# Altium project PA-HF_100W-VHF_60W.PrjPcb (part 2 of 2)

## Sheet PA-LPF.SchDoc
size A4 portrait; SheetNumber: 4; SheetTotal: 5
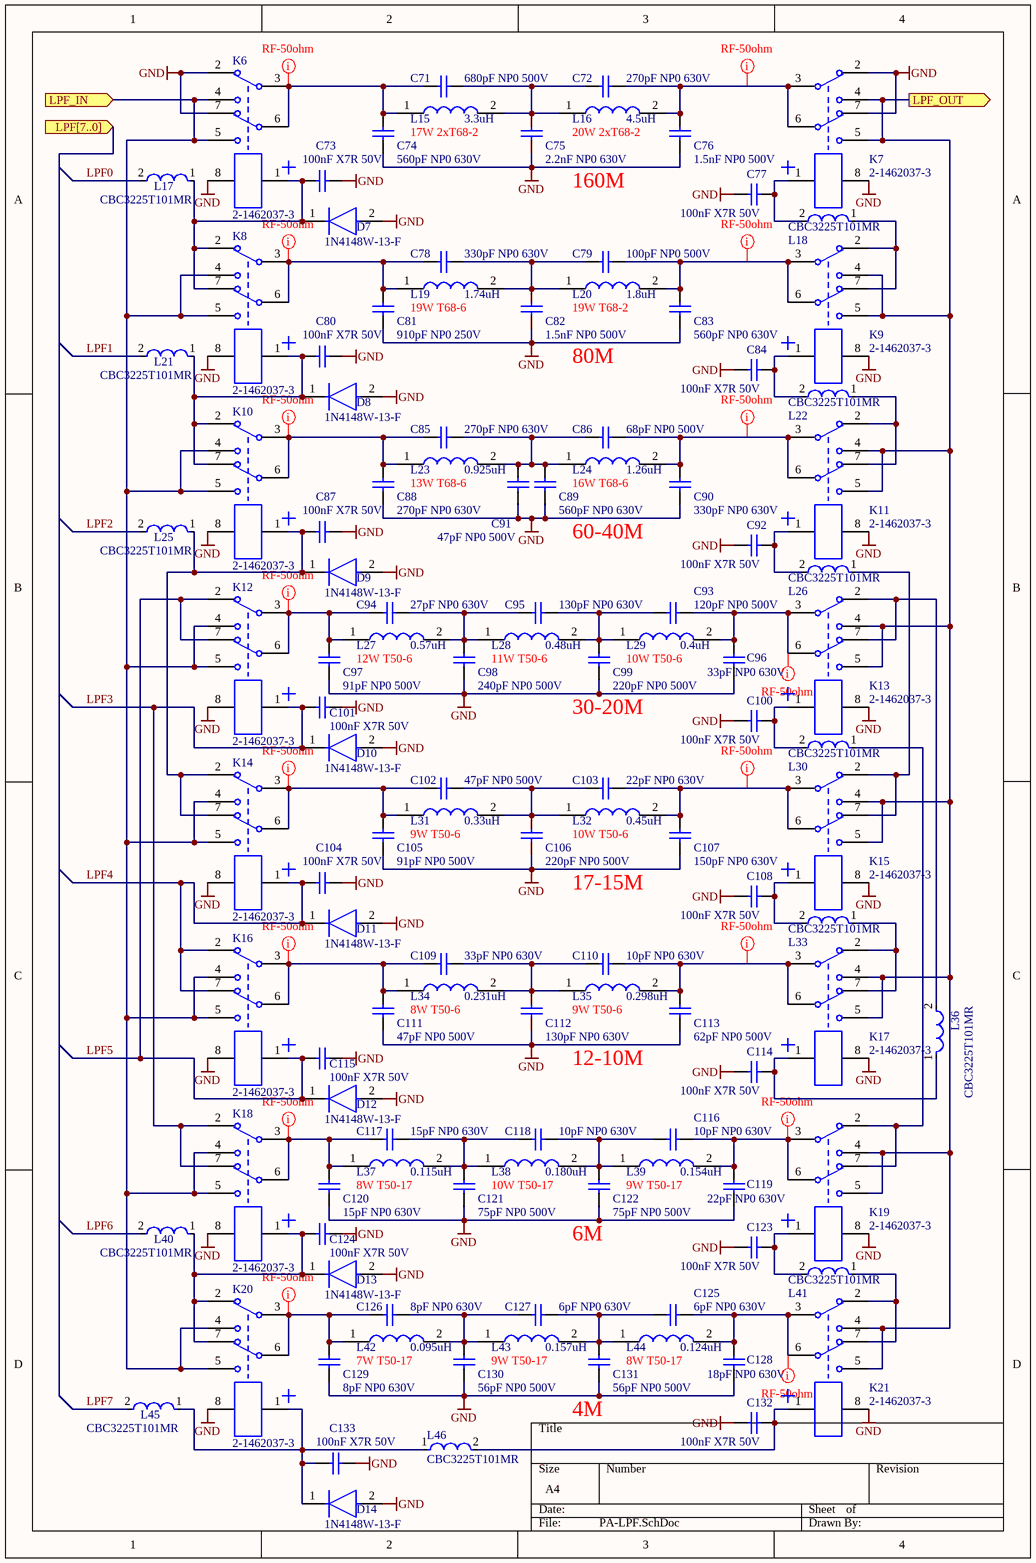
[diagram p3: PA-LPF.SchDoc]

### Parts
C71  680pF NP0 500V  [C-1206]
C72  270pF NP0 630V  [C-1206]
C73  100nF X7R 50V  [C-0805]
C74  560pF NP0 630V  [C-1206]
C75  2.2nF NP0 630V  [C-1206]
C76  1.5nF NP0 500V  [C-1206]
C77  100nF X7R 50V  [C-0805]
C78  330pF NP0 630V  [C-1206]
C79  100pF NP0 500V  [C-1206]
C80  100nF X7R 50V  [C-0805]
C81  910pF NP0 250V  [C-1206]
C82  1.5nF NP0 500V  [C-1206]
C83  560pF NP0 630V  [C-1206]
C84  100nF X7R 50V  [C-0805]
C85  270pF NP0 630V  [C-1206]
C86  68pF NP0 500V  [C-1206]
C87  100nF X7R 50V  [C-0805]
C88  270pF NP0 630V  [C-1206]
C89  560pF NP0 630V  [C-1206]
C90  330pF NP0 630V  [C-1206]
C91  47pF NP0 500V  [C-1206]
C92  100nF X7R 50V  [C-0805]
C93  120pF NP0 500V  [C-1206]
C94  27pF NP0 630V  [C-1206]
C95  130pF NP0 630V  [C-1206]
C96  33pF NP0 630V  [C-1206]
C97  91pF NP0 500V  [C-1206]
C98  240pF NP0 500V  [C-1206]
C99  220pF NP0 500V  [C-1206]
C100  100nF X7R 50V  [C-0805]
C101  100nF X7R 50V  [C-0805]
C102  47pF NP0 500V  [C-1206]
C103  22pF NP0 630V  [C-1206]
C104  100nF X7R 50V  [C-0805]
C105  91pF NP0 500V  [C-1206]
C106  220pF NP0 500V  [C-1206]
C107  150pF NP0 630V  [C-1206]
C108  100nF X7R 50V  [C-0805]
C109  33pF NP0 630V  [C-1206]
C110  10pF NP0 630V  [C-1206]
C111  47pF NP0 500V  [C-1206]
C112  130pF NP0 630V  [C-1206]
C113  62pF NP0 500V  [C-1206]
C114  100nF X7R 50V  [C-0805]
C115  100nF X7R 50V  [C-0805]
C116  10pF NP0 630V  [C-1206]
C117  15pF NP0 630V  [C-1206]
C118  10pF NP0 630V  [C-1206]
C119  22pF NP0 630V  [C-1206]
C120  15pF NP0 630V  [C-1206]
C121  75pF NP0 500V  [C-1206]
C122  75pF NP0 500V  [C-1206]
C123  100nF X7R 50V  [C-0805]
C124  100nF X7R 50V  [C-0805]
C125  6pF NP0 630V  [C-1206]
C126  8pF NP0 630V  [C-1206]
C127  6pF NP0 630V  [C-1206]
C128  18pF NP0 630V  [C-1206]
C129  8pF NP0 630V  [C-1206]
C130  56pF NP0 500V  [C-1206]
C131  56pF NP0 500V  [C-1206]
C132  100nF X7R 50V  [C-0805]
C133  100nF X7R 50V  [C-0805]
D7  1N4148W-13-F  [FP-SOD123-MFG]
D8  1N4148W-13-F  [FP-SOD123-MFG]
D9  1N4148W-13-F  [FP-SOD123-MFG]
D10  1N4148W-13-F  [FP-SOD123-MFG]
D11  1N4148W-13-F  [FP-SOD123-MFG]
D12  1N4148W-13-F  [FP-SOD123-MFG]
D13  1N4148W-13-F  [FP-SOD123-MFG]
D14  1N4148W-13-F  [FP-SOD123-MFG]
K6  2-1462037-3  [TECO-2-1462037-3_V]
K7  2-1462037-3  [TECO-2-1462037-3_V]
K8  2-1462037-3  [TECO-2-1462037-3_V]
K9  2-1462037-3  [TECO-2-1462037-3_V]
K10  2-1462037-3  [TECO-2-1462037-3_V]
K11  2-1462037-3  [TECO-2-1462037-3_V]
K12  2-1462037-3  [TECO-2-1462037-3_V]
K13  2-1462037-3  [TECO-2-1462037-3_V]
K14  2-1462037-3  [TECO-2-1462037-3_V]
K15  2-1462037-3  [TECO-2-1462037-3_V]
K16  2-1462037-3  [TECO-2-1462037-3_V]
K17  2-1462037-3  [TECO-2-1462037-3_V]
K18  2-1462037-3  [TECO-2-1462037-3_V]
K19  2-1462037-3  [TECO-2-1462037-3_V]
K20  2-1462037-3  [TECO-2-1462037-3_V]
K21  2-1462037-3  [TECO-2-1462037-3_V]
L15  17W 2xT68-2  value 3.3uH  [Amidon_2xT68_2]
L16  20W 2xT68-2  value 4.5uH  [Amidon_2xT68_2]
L17  CBC3225T101MR  [FP-CB3225-MFG]
L18  CBC3225T101MR  [FP-CB3225-MFG]
L19  19W T68-6  value 1.74uH  [Amidon_T68_6-smd]
L20  19W T68-2  value 1.8uH  [Amidon_T68_2-smd]
L21  CBC3225T101MR  [FP-CB3225-MFG]
L22  CBC3225T101MR  [FP-CB3225-MFG]
L23  13W T68-6  value 0.925uH  [Amidon_T68_6-smd]
L24  16W T68-6  value 1.26uH  [Amidon_T68_6-smd]
L25  CBC3225T101MR  [FP-CB3225-MFG]
L26  CBC3225T101MR  [FP-CB3225-MFG]
L27  12W T50-6  value 0.57uH  [Amidon_T50_6-smd]
L28  11W T50-6  value 0.48uH  [Amidon_T50_6-smd]
L29  10W T50-6  value 0.4uH  [Amidon_T50_6-smd]
L30  CBC3225T101MR  [FP-CB3225-MFG]
L31  9W T50-6  value 0.33uH  [Amidon_T50_6-smd]
L32  10W T50-6  value 0.45uH  [Amidon_T50_6-smd]
L33  CBC3225T101MR  [FP-CB3225-MFG]
L34  8W T50-6  value 0.231uH  [Amidon_T50_6-smd]
L35  9W T50-6  value 0.298uH  [Amidon_T50_6-smd]
L36  CBC3225T101MR  [FP-CB3225-MFG]
L37  8W T50-17  value 0.115uH  [Amidon_T50_17-smd]
L38  10W T50-17  value 0.180uH  [Amidon_T50_17-smd]
L39  9W T50-17  value 0.154uH  [Amidon_T50_17-smd]
L40  CBC3225T101MR  [FP-CB3225-MFG]
L41  CBC3225T101MR  [FP-CB3225-MFG]
L42  7W T50-17  value 0.095uH  [Amidon_T50_17-smd]
L43  9W T50-17  value 0.157uH  [Amidon_T50_17-smd]
L44  8W T50-17  value 0.124uH  [Amidon_T50_17-smd]
L45  CBC3225T101MR  [FP-CB3225-MFG]
L46  CBC3225T101MR  [FP-CB3225-MFG]

### Ports
LPF[7..0] (in), LPF_IN (in), LPF_OUT (out)

### Nets
GND: C73.2 C74.1 C75.1 C76.1 C77.2 C80.2 C81.1 C82.1 C83.1 C84.2 C87.2 C88.1 C89.1 C90.1 C91.1 C92.2 C96.2 C97.2 C98.2 C99.2 C100.2 C101.2 C104.2 C105.2 C106.2 C107.2 C108.2 C111.2 C112.2 C113.2 C114.1 C115.2 C119.2 C120.1 C121.2 C122.2 C123.2 C124.2 C128.2 C129.1 C130.2 C131.2 C132.1 C133.2 D7.2(A) D8.2(A) D9.2(A) D10.2(A) D11.2(A) D12.2(A) D13.2(A) D14.2(A) K6.2 K6.7 K6.8 K7.2 K7.7 K7.8 K8.8 K9.8 K10.8 K11.8 K12.8 K13.8 K14.8 K15.8 K16.8 K17.8 K18.8 K19.8 K20.8 K21.8
LPF0: L17.2
LPF1: L21.2
LPF2: L25.2
LPF3: C101.1 D10.1(C) K12.1 K18.2 K18.7
LPF4: C104.1 D11.1(C) K14.1 K16.2 K16.7
LPF5: C115.1 D12.1(C) K12.2 K12.7 K16.1
LPF6: L40.2
LPF7: L45.2
NetC71_1: C71.1 C74.2 K6.3 K6.6 L15.1
NetC71_2: C71.2 C72.1 C75.2 L15.2 L16.1
NetC72_2: C72.2 C76.2 K7.3 K7.6 L16.2
NetC73_1: C73.1 D7.1(C) K6.1 K8.2 K8.7 L17.1
NetC77_1: C77.1 K7.1 L18.2
NetC78_1: C78.1 C81.2 K8.3 K8.6 L19.1
NetC78_2: C78.2 C79.1 C82.2 L19.2 L20.1
NetC79_2: C79.2 C83.2 K9.3 K9.6 L20.2
NetC80_1: C80.1 D8.1(C) K8.1 K10.2 K10.7 L21.1
NetC84_1: C84.1 K9.1 L22.2
NetC85_1: C85.1 C88.2 K10.3 K10.6 L23.1
NetC85_2: C85.2 C86.2 C89.2 C91.2 L23.2 L24.1
NetC86_1: C86.1 C90.2 K11.3 K11.6 L24.2
NetC87_1: C87.1 D9.1(C) K10.1 K14.2 K14.7 L25.1
NetC92_1: C92.1 K11.1 L26.2
NetC93_1: C93.1 C96.1 K13.3 K13.6 L29.2
NetC93_2: C93.2 C95.1 C99.1 L28.2 L29.1
NetC94_1: C94.1 C95.2 C98.1 L27.2 L28.1
NetC94_2: C94.2 C97.1 K12.3 K12.6 L27.1
NetC100_1: C100.1 K13.1 L30.2
NetC102_1: C102.1 C103.2 C106.1 L31.2 L32.1
NetC102_2: C102.2 C105.1 K14.3 K14.6 L31.1
NetC103_1: C103.1 C107.1 K15.3 K15.6 L32.2
NetC108_1: C108.1 K15.1 L33.2
NetC109_1: C109.1 C111.1 K16.3 K16.6 L34.1
NetC109_2: C109.2 C110.1 C112.1 L34.2 L35.1
NetC110_2: C110.2 C113.1 K17.3 K17.6 L35.2
NetC114_2: C114.2 K17.1 L36.1
NetC116_1: C116.1 C118.2 C122.1 L38.2 L39.1
NetC116_2: C116.2 C119.1 K19.3 K19.6 L39.2
NetC117_1: C117.1 C120.2 K18.3 K18.6 L37.1
NetC117_2: C117.2 C118.1 C121.1 L37.2 L38.1
NetC123_1: C123.1 K19.1 L41.2
NetC124_1: C124.1 D13.1(C) K18.1 K20.2 K20.7 L40.1
NetC125_1: C125.1 C127.2 C131.1 L43.2 L44.1
NetC125_2: C125.2 C128.1 K21.3 K21.6 L44.2
NetC126_1: C126.1 C129.2 K20.3 K20.6 L42.1
NetC126_2: C126.2 C127.1 C130.1 L42.2 L43.1
NetC132_2: C132.2 K21.1 L46.2
NetC133_1: C133.1 D14.1(C) K20.1 L45.1 L46.1
NetK3_2: K7.4 K7.5 K9.4 K9.5 K11.4 K11.5 K13.4 K13.5 K15.4 K15.5 K17.4 K17.5 K19.4 K19.5 K21.4 K21.5 ; port LPF_OUT
NetK6_4: K6.4 K6.5 K8.4 K8.5 K10.4 K10.5 K12.4 K12.5 K14.4 K14.5 K16.4 K16.5 K18.4 K18.5 K20.4 K20.5 ; port LPF_IN
NetK9_2: K9.2 K9.7 L18.1
NetK11_2: K11.2 K11.7 L22.1
NetK13_2: K13.2 K13.7 L36.2
NetK15_2: K15.2 K15.7 L26.1
NetK17_2: K17.2 K17.7 L33.1
NetK19_2: K19.2 K19.7 L30.1
NetK21_2: K21.2 K21.7 L41.1

### Layout directives
rule Width Constraint [Pref Impedance = 50,00ohms    Min Impedance = 50,00ohms    Max Impedance = 50,00ohms]: NetC71_1, NetC72_2, NetC78_1, NetC79_2, NetC85_1, NetC86_1, NetC93_1, NetC94_2, NetC102_2, NetC103_1, NetC109_1, NetC110_2, NetC116_2, NetC117_1, NetC125_2, NetC126_1

### Notes on the sheet
- 160M
- 80M
- 60-40M
- (near C99) 30-20M
- 17-15M
- 12-10M
- (near C122) 6M
- (near C131) 4M

### Library data of the parts
C71 = C semi: Ceramic Multilayer Capacitor; Manufacturer P/N: CL31C681JGHNNNE
C72 C85 C88 = C semi: Ceramic Multilayer Capacitor; Manufacturer P/N: C1206C271JBGACAUTO
C73 C77 C80 C84 C87 C92 C96 C100 C101 C104 C108 C109 C114 C115 C123 C124 C132 C133 = C semi: Ceramic Multilayer Capacitor; Manufacturer P/N: GRM31A5C2J330JW01D
C74 C83 C89 = C semi: Ceramic Multilayer Capacitor; Manufacturer P/N: GRM31A5C2J561JW01D
C75 = C semi: Ceramic Multilayer Capacitor; Manufacturer P/N: C3216C0G2J222J115AA
C76 C82 = C semi: Ceramic Multilayer Capacitor; Manufacturer P/N: CC1206JRNPOBBN152
C78 C90 = C semi: Ceramic Multilayer Capacitor; Manufacturer P/N: C3216C0G2J331J060AA
C79 = C semi: Ceramic Multilayer Capacitor; Manufacturer P/N: AC1206JRNPOBBN101
C81 = C semi: Ceramic Multilayer Capacitor; Manufacturer P/N: 1206Y2500911KQT
C86 = C semi: Ceramic Multilayer Capacitor; Manufacturer P/N: CC1206JRNPOBBN680
C91 C102 C111 = C semi: Ceramic Multilayer Capacitor; Manufacturer P/N: CC1206JRNPOBBN470
C93 = C semi: Ceramic Multilayer Capacitor; Manufacturer P/N: CGJ5C4C0G2H121J060AA
C94 = C semi: Ceramic Multilayer Capacitor; Manufacturer P/N: C1206C270JBGAC7800
C95 C112 = C semi: Ceramic Multilayer Capacitor; Manufacturer P/N: 1206Y6300131JQT
C97 C105 = C semi: Ceramic Multilayer Capacitor; Manufacturer P/N: VJ1206A910KBEAT4X
C98 = C semi: Ceramic Multilayer Capacitor; Manufacturer P/N: 1206Y5000241JQT
C99 C106 = C semi: Ceramic Multilayer Capacitor; Manufacturer P/N: CL31C221JGFNNNE
C103 C119 C128 = C semi: Ceramic Multilayer Capacitor; Manufacturer P/N: CL31C220JHFNNNE
C107 = C semi: Ceramic Multilayer Capacitor; Manufacturer P/N: C3216C0G2J151J060AA
C110 C116 C118 C125 C127 = C semi: Ceramic Multilayer Capacitor; Manufacturer P/N: GRM31A5C2J100JW01D
C113 = C semi: Ceramic Multilayer Capacitor; Manufacturer P/N: VJ1206A620JXEMC
C117 C120 C126 C129 = C semi: Ceramic Multilayer Capacitor; Manufacturer P/N: CL31C150JHFNNNE
C121 C122 C130 C131 = C semi: Ceramic Multilayer Capacitor; Manufacturer P/N: VJ1206A750JBEAT4X
D7-D14 = CMP-12791-000005-1: DIODE GEN PURP 100V 150MA SOD123; Manufacturer: Diodes Inc.; Capacitance: 2pF; Forward Current: 300mA; Max Junction Temp: +150°C; Value: 2pF; Standoff Height: 0mm; Peak Reverse Current: 1uA; Max Surge Forward Current: 1A; Category: Diode; Height: 1.45mm; ComponentLink2URL: https://upverter.com/datasheet/628e7d6fee5901eee6eef4567d1c3569f2cd3cde.pdf; Lead Free: Yes; ComponentLink2Description: Datasheet; Octopart: https://octopart.com/1n4148w-13-f-diodes+inc.-2359612; Temperature Range High: +150°C; Device Class L2: Diodes; Digikey Description: DIODE GEN PURP 100V 150MA SOD123; Reverse Voltage: 100V; Temperature Range Low: -65°C; Device Class L1: Discrete Semiconductors; Package: SOD123; RoHS: TRUE; Manufacturer Part Number: 1N4148W-13-F; Footprint Url: https://www.diodes.com/assets/Package-Files/SOD123.pdf; Automotive: No; Max Repetitive Reverse Voltage: 100V; Mouser Description: 1N4148W Series 2 A 100 V 400 mW Surface Mount Fast Switching Diode - SOD-123; Temperature: -65°C to +150°C; Device Class L3: Rectifier Diodes
K6-K21 = CMP-2000-05409-1: Signal Relay, 2 A, 12 VDC, -40 to 85 degC, 8-Pin SMD, RoHS, Tape and Reel; Manufacturer: TE Connectivity; Coil Suppression Diode: No; Contact Arrangement: DPDT; Product Length (mm): 10mm; Product Height (mm): 5.65mm; Coil Voltage DC: 12V; Pick-up Voltage (Max): 9VDC; Coil Resistance: 1.029kohm; Voltage Rating (VDC): 220; Dropout Volt: 1.2VDC; Operate Time: 1ms; Contact Current Rating: 2A; Relay Construction: Non-Latching; Seal: Unsealed; Maximum Power Rating: 60W/62.5VA; Product Depth (mm): 7.5mm; Coil Current: 11.67mA; Voltage Rating (VAC): 250V; Contact Form: 2FormC; Contact Material: PalladiumRuthenium/Gold; Pin Count: 8; LED Indicator: No; Operating Temp Range: -40Cto85C; Push To Test Button: No; Mounting Style: SurfaceMount; Type: SignalRelay; Packaging: TapeandReel; Datasheet Version: Rev. 0116, 01/2016; Manufacturer URL: http://www.te.com/; Datasheet URL: http://www.te.com/commerce/DocumentDelivery/DDEController?Action=srchrtrv&DocNm=108-98001&DocType=SS&DocLang=EN; Termination Style: GullWing
L15 L16 L19 L20 L23 L24 L27-L29 L31 L32 L34 L35 L37-L39 L42-L44 = Amidon
L17 L18 L21 L22 L25 L26 L30 L33 L36 L40 L41 L45 L46 = CMP-14484-000373-1: SMD Inductors 100uH ±20% 0.34A 1.82Ω 1210; Resistance: 1.4R; DC Current: 340mA; DC Resistance (DCR): 1.82R; Saturation Current: 270mA; Self Resonant Frequency: 6MHz; Core Material: Ferrite; Inductor Type: POWER; Shielding: Unshielded; Test Frequency: 100kHz; Max Operating Temperature: 105°C; Length: 0.126inch; Inductance: 100uH; Current Rating: 340mA; Resistor Type: Wirewound; Halogen Free: Halogen Free; Height - Seated (Max): 0.106inch; Case/Package: 1210; Package Quantity: 1000; Lead Free: Lead Free; Series: CB; Tolerance: 20%; Depth: 2.7mm; Number of Pins: 2; Width: 0.098inch; Termination: SMD/SMT; Min Operating Temperature: -40°C; Max DC Current: 340mA; Inductance Tolerance: 20%; Radiation Hardening: No; Military Standard: Not; Height: 2.5mm; Case Code (Metric): 3225; Packaging: Tape and Reel; Mount: Surface Mount; RoHS Compliant: Yes; Case Code (Imperial): 1210

## Sheet PA-VHF_60W.SchDoc
size A4; SheetNumber: 3; SheetTotal: 5
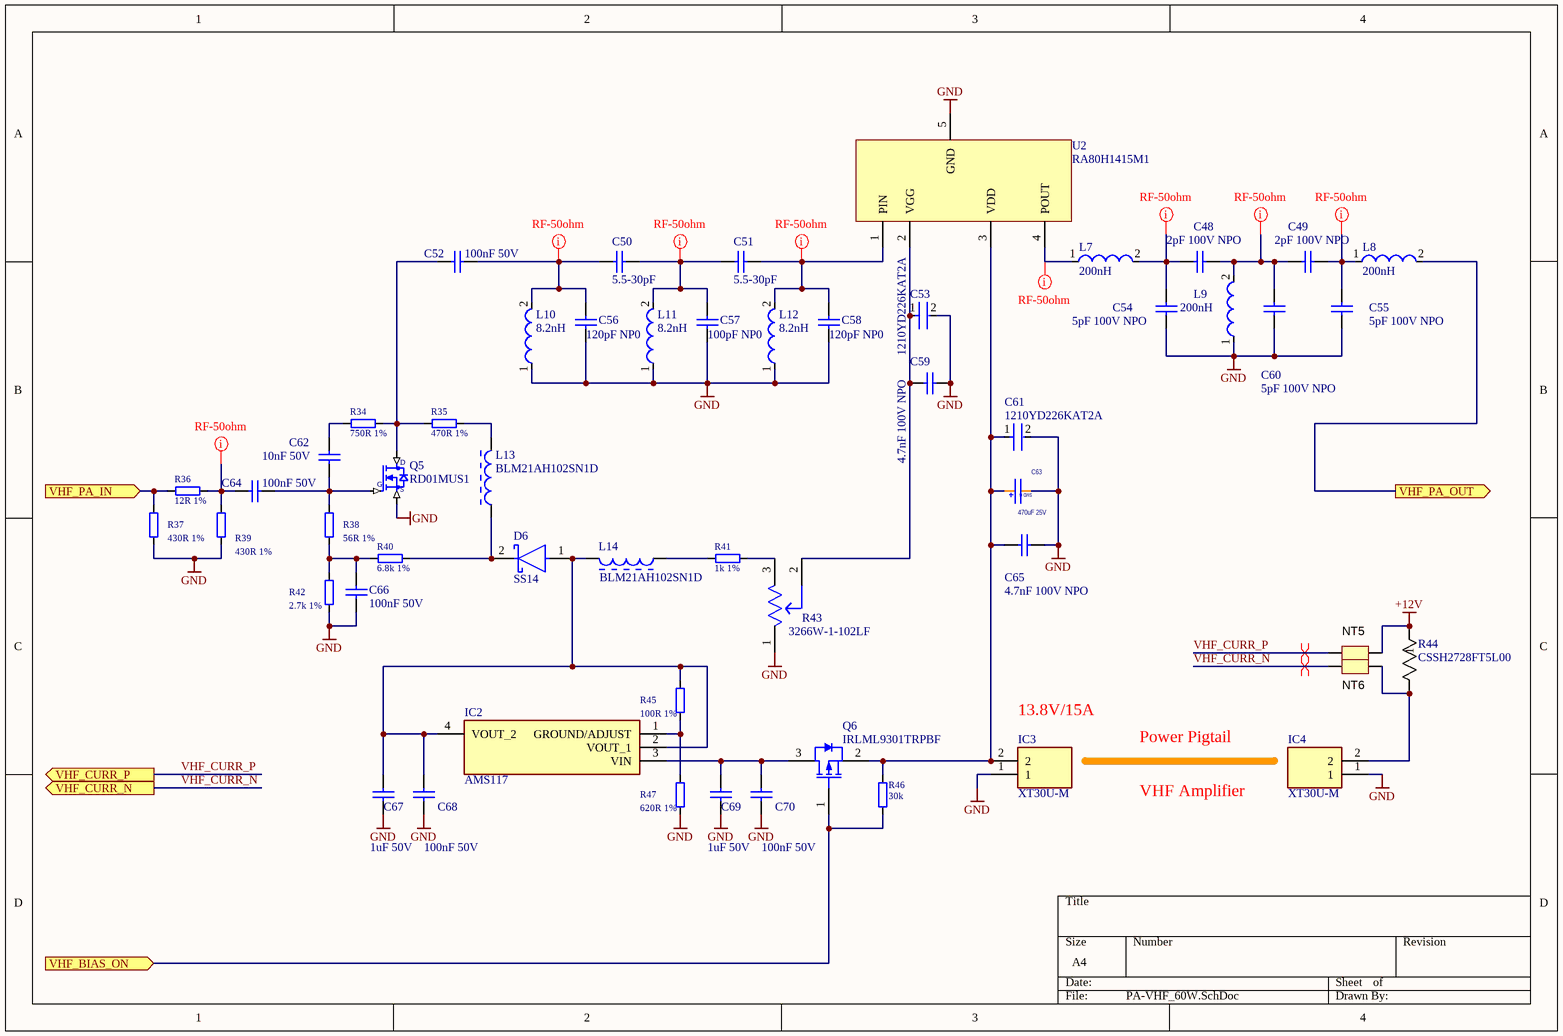
[diagram p4: PA-VHF_60W.SchDoc]

### Parts
C48  2pF 100V NPO  [C-1206]
C49  2pF 100V NPO  [C-1206]
C50  5.5-30pF  [CAP-ADJ-SMD_L4.5-W3.2-L]
C51  5.5-30pF  [CAP-ADJ-SMD_L4.5-W3.2-L]
C52  100nF 50V  [C-0805]
C53  1210YD226KAT2A  [FP-1210-L_3_3_0_4-W_2_5_0-MFG]
C54  5pF 100V NPO  [C-1206]
C55  5pF 100V NPO  [C-1206]
C56  120pF NP0  [C-0805]
C57  100pF NP0  [C-0805]
C58  120pF NP0  [C-0805]
C59  4.7nF 100V NPO  [C-1206]
C60  5pF 100V NPO  [C-1206]
C61  1210YD226KAT2A  [FP-1210-L_3_3_0_4-W_2_5_0-MFG]
C62  10nF 50V  [C-0805]
C63  470uF 25V  [SMD-G-10X10.2]
C64  100nF 50V  [C-0805]
C65  4.7nF 100V NPO  [C-1206]
C66  100nF 50V  [C-0805]
C67  1uF 50V  [C-0805]
C68  100nF 50V  [C-0805]
C69  1uF 50V  [C-0805]
C70  100nF 50V  [C-0805]
D6  SS14  [FP-403AE-MFG]
IC2  AMS117  [SOT229P700X180-4N]
IC3  XT30U-M  [XT30UM]
IC4  XT30U-M  [XT30UM]
L7  200nH  [AirCoil_200nH]
L8  200nH  [AirCoil_200nH]
L9  200nH  [AirCoil_200nH]
L10  8.2nH  [L-0805]
L11  8.2nH  [L-0805]
L12  8.2nH  [L-0805]
L13  BLM21AH102SN1D  [INDC2013X105X50LL20T20]
L14  BLM21AH102SN1D  [INDC2013X105X50LL20T20]
NT5  Net-Tie  [Net-Tie_10mil]  (value not drawn)  (net tie, no BOM)
NT6  Net-Tie  [Net-Tie_10mil]  (value not drawn)  (net tie, no BOM)
Q5  RD01MUS1  [RD01MUS2_MTS]
Q6  IRLML9301TRPBF  [INF-SOT-23-3_V]
R34  750R 1%  [R-0805]
R35  470R 1%  [R-0805]
R36  12R 1%  [R-0805]
R37  430R 1%  [R-0805]
R38  56R 1%  [R-0805]
R39  430R 1%  [R-0805]
R40  6.8k 1%  [R-0805]
R41  1k 1%  [R-0805]
R42  2.7k 1%  [R-0805]
R43  3266W-1-102LF  [FP-3266W-MFG]
R44  CSSH2728FT5L00  [STA_CSSH2728_STP]
R45  100R 1%  [R-0805]
R46  30k  [R-0603]
R47  620R 1%  [R-0805]
U2  RA80H1415M1  [RA80H1415M1]

### Ports
VHF_BIAS_ON (in), VHF_CURR_N (out), VHF_CURR_P (out), VHF_PA_IN (in), VHF_PA_OUT (out)

### Nets
+12V: NT5.2 R44.1
GND: C53.2 C54.1 C55.1 C56.2 C57.2 C58.2 C59.2 C60.1 C61.2 C63.2 C65.2 C66.1 C67.1 C68.1 C69.1 C70.1 IC3.1 IC4.1 L9.1 L10.1 L11.1 L12.1 Q5.1(S) R37.1 R39.1 R42.1 R43.1(CCW) R47.1 U2.5(GND)
VHF_BIAS_ON: Q6.1(GATE) R46.2 ; port VHF_BIAS_ON
VHF_CURR_N: NT6.1 ; port VHF_CURR_N
VHF_CURR_P: NT5.1 ; port VHF_CURR_P
NetC48_1: C48.1 C54.2 L7.2
NetC48_2: C48.2 C49.1 C60.2 L9.2
NetC49_2: C49.2 C55.2 L8.1
NetC50_1: C50.1 C52.2 C56.1 L10.2
NetC50_2: C50.2 C51.1 C57.1 L11.2
NetC51_2: C51.2 C58.1 L12.2 U2.1(PIN)
NetC52_1: C52.1 Q5.3(D) R34.1 R35.2
NetC53_1: C53.1 C59.1 R43.2(WIPER) U2.2(VGG)
NetC61_1: C61.1 C63.1 C65.1 IC3.2 Q6.2(SOURCE) R46.1 U2.3(VDD)
NetC62_1: C62.1 C64.2 Q5.2 R38.2
NetC62_2: C62.2 R34.2
NetC64_1: C64.1 R36.2 R39.2
NetC66_2: C66.2 R38.1 R40.2 R42.2
NetC67_2: C67.2 C68.2 D6.1(A) IC2.2(VOUT_1) IC2.4(VOUT_2) L14.2 R45.2
NetC69_2: C69.2 C70.2 IC2.3(VIN) Q6.3(DRAIN)
NetD6_2: D6.2(C) L13.1 R40.1
NetIC2_1: IC2.1(GROUND/ADJUST) R45.1 R47.2
NetIC4_2: IC4.2 NT6.2 R44.2
NetK3_4: L8.2 ; port VHF_PA_OUT
NetK4_4: R36.1 R37.2 ; port VHF_PA_IN
NetL7_1: L7.1 U2.4(POUT)
NetL13_2: L13.2 R35.1
NetL14_1: L14.1 R41.2
NetR41_1: R41.1 R43.3(CW)

### Layout directives
rule Width Constraint [Pref Impedance = 50,00ohms    Min Impedance = 50,00ohms    Max Impedance = 50,00ohms]: NetC48_1, NetC48_2, NetC49_2, NetC50_1, NetC50_2, NetC51_2, NetC64_1, NetL7_1
differential pair: VHF_CURR_N, VHF_CURR_P

### Notes on the sheet
- (near IC3) 13.8V/15A
- Power Pigtail
- VHF Amplifier
- (in symbol RD01MUS1) G
- (in symbol SMD-G 470uF 25V) SMD G

### Library data of the parts
C48 C49 C52 C54 C55 C59 C60 C62 C64-C70 = C semi: Ceramic Multilayer Capacitor
C50 C51 C56-C58 = C semi: Ceramic Multilayer Capacitor; Manufacturer: Yageo/Phycomp; Manufacturer P/N: CC0603JRNPO9BN102; numsch: 011; TypeNum: 155; Parameters: 1nF, NP0, 50V, ±5%; Tolerance: ±10%; Voltage: *
C53 C61 = CMP-2000-05483-2: General Purpose Ceramic Capacitor, 1210, 22uF, 10%, X5R, 15%, 16V; Tolerance: 10%; Width: 0.098inch; Length: 3.2mm; Min Operating Temperature: -55°C; Capacitance: 22uF; Case/Package: 1210; Termination: SMD/SMT; Voltage: 16V; Number of Pins: 2; Thickness: 0.11inch; Height: 2.79mm; Weight: 0.000564oz; Case Code (Imperial): 1210; Contact Plating: Tin; Lead Free: Lead Free; RoHS Compliant: Yes; Packaging: Tape and Reel; Package Quantity: 1; Construction: Flat; Series: -; REACH SVHC: No SVHC; Case Code (Metric): 3225; Size: 2.79mm; Radiation Hardening: No; Voltage Rating: 16V; Depth: 2.5mm; Mount: Surface Mount; Voltage Rating (DC): 16V; Dielectric: X5R; Max Operating Temperature: 85°C
C63 = SMD-G 470uF 25V: CAP ALUM 470UF 20% 25V SMD; Manufacturer: KEMET; Manufacturer PartNumber: EDH477M025A9PAA; Value: 470µF; Pricing Аlternative: 0.05; Temp.Characteristic: –55 °C to +105 °C; Note: Aluminum Electrolytic Capacitors; Detailed Description: 470µF 25V Aluminum Electrolytic Capacitors Radial, Can - SMD  2000 Hrs @ 105°C; Lifetime @ Temp: 2000Hrs@105℃; ComponentLink2URL: http://www.mouser.com/ds/2/315/ABA0000C1181-947564.pdf; Dealer Digi-Key: https://www.digikey.com/product-detail/en/kemet/EDH477M025A9PAA/EDH477M025A9PAA-ND/6597660; Dealer Аlternative: https://detail.1688.com/offer/541866342432.html; Package / Case: G, 0.394" Dia (10.00mm); Pricing Digi-Key: 0.21; Publisher: Catcatcat Electronics; Tolerance: ±20 %; Voltage: 25V; HelpURL: https://api.kemet.com/component-edge/download/datasheet/EDH477M025A9PAA.pdf; website developer: http://catcatcat.d-lan.dp.ua/; PartNumber Digi-Key: EDH477M025A9PAA; Assembly type: Manual Part
D6 = CMP-2000-04943-2: DIODE SCHOTTKY 40V 1A SMA; Manufacturer: ON Semiconductor; Peak Reverse Current: 0.2mA; Max Junction Temp: +125°C; Standoff Height: 0.05mm; Max Surge Forward Current: 40A; Mouser Description: Schottky Diodes & Rectifiers SMA 40V 1.0A; RoHS: TRUE; Lead Free: Yes; Manufacturer Part Number: SS14; Device Class L3: Schottky Diodes; Category: Diode; Automotive: No; Digikey Description: DIODE SCHOTTKY 40V 1A SMA; ComponentLink2Description: Datasheet; Device Class L2: Diodes; Height: 2.5mm; Temperature Range High: +125°C; ComponentLink2URL: https://www.onsemi.com/pub/Collateral/SS19-D.PDF; Device Class L1: Discrete Semiconductors; Package: 403AE; Octopart: https://octopart.com/ss14-on+semiconductor-29205033; Max Repetitive Reverse Voltage: 40V; Temperature Range Low: -65°C; Forward Current: 1A; Temperature: -65°C to +125°C
IC2 = AMS117: Integrated Circuit; Manufacturer_Name: Advanced Monolithic Systems; Datasheet Link: http://www.advanced-monolithic.com/pdf/ds1117.pdf; Height: 1.8mm; Manufacturer_Part_Number: AMS117
IC3 IC4 = XT30U-M: Integrated Circuit; Manufacturer_Name: Amass; Datasheet Link: https://www.tme.eu/Document/3cbfa5cfa544d79584972dd5234a409e/XT30U%20SPEC.pdf; Height: 10.7mm; Manufacturer_Part_Number: XT30U-M
L7-L12 = RF_inductor
L13 L14 = CMP-2000-05954-1: Chip Bead, 1000 Ohm, +/- 25%, 200 mA, -55 to 85 degC, 2-Pin SMD, RoHS, Tape and Reel; Manufacturer: Murata; Brand: MurataElectronics; Test Frequency: 100MHz; Maximum DC Resistance: 450mOhms; Case Length: 2mm; Maximum DC Current: 200mA; Case Height: 0.85mm; Case Width: 1.25mm; Impedance: 1kOhms; Datasheet URL: http://datasheet.octopart.com/BLM21AH102SN1D-Murata-datasheet-629859.pdf; Datasheet Version: 11/2017; Dimensions: 1.25mmWx2mmLx0.85mmH; Manufacturer URL: http://www.murata.com/; Packaging: Reel; Product: FerriteChipBeads; Product Category: EMIFilterBeads,Chips&Arrays; Operating Temperature Range: -55Cto+125C; Package / Case: 0805(2012metric); Series: BLM21A; Mounting Technology: SurfaceMount; Termination Style: SMD/SMT; Tolerance: 25%; RoHS: Details; Package Reference: 0805; Factory Pack Quantity: 4000; Package Description: 2-Pin Surface Mount Device, Body 2 x1.25 mm
NT5 NT6 = Net-Tie: Single point connection between nets.; SymbolCreator: codlsc; SymbolVersion: 2009-07-01; MountType: SMT; PackageReference: N/A; Publisher: Texas Instruments; LatestRevisionDate: 2014-12-30; LatestRevisionNote: Added Alternate PartNumber and Alternate Manufacturer parameters to appropriate components.
Q6 = CMP-2000-06487-1: HEXFET(R) Power MOSFET, 3.6 A, 30 V, -55 to 150 degC, 3-Pin SOT-23, RoHS, Tape and Reel; Manufacturer: InfineonTechnologies; Drain to Source Voltage (Vdss): 30V; Gate Charge (Qg) @ Vgs: 4.8nC@4.5V; Rds On (Max) @ Id, Vgs: 64mOhm@3.6A,10V; FET Type: MOSFETP-Channel,MetalOxide; Current - Continuous Drain (Id) @ 25°C: 3.6A(Ta); Power - Max: 1.3W; Vgs(th) (Max) @ Id: 2.4V@10µA; FET Feature: Standard; Input Capacitance (Ciss) @ Vds: 388pF@25V; Operating Temperature: -55°C~150°C(TJ); Series: HEXFET®; Family: Transistors-FETs,MOSFETs-Single; Manufacturer URL: http://www.infineon.com/; Package Reference: SOT-23-3; Datasheet Version: 02/2012; Category: DiscreteSemiconductorProducts; Part Status: Active; Mounting Technology: SurfaceMount; Datasheet URL: http://www.infineon.com/dgdl/irlml9301pbf.pdf?fileId=5546d462533600a401535668e5e42640; Supplier Device Package: Micro3™/SOT-23; Mounting Type: SurfaceMount; Packaging: Tape&Reel(TR); Package / Case: TO-236-3,SC-59,SOT-23-3; Package Description: 3-Pin Small Outline Transistor, Body 2.92 x 1.3 mm, Pitch 0.95 mm
R34-R42 R45 R47 = RES semi: Chip Resistor; Power: *; TCR: *; Series: *; Tolerance: *
R43 = CMP-07234-000016-1: TRIMMER 1K OHM 0.25W PC PIN TOP; Manufacturer: Bourns; Manufacturer Part Number: 3266W-1-103LF; Temperature Coefficient: 100ppm/°C; Tolerance: 10%; Value: 10kΩ; Standoff Height: 0.43mm; Device Class L3: Variable Resistors and Potentiometers; ComponentLink2URL: https://www.bourns.com/docs/Product-Datasheets/3266.pdf; ComponentLink2Description: Datasheet; Device Class L2: Resistors; Power Rating: 0.25W; Mouser Description: Trimmer Resistors - Through Hole 1/4 10Kohms 10% SQ W/Standoff Sealed; Category: Res; Digikey Description: TRIMMER 10K OHM 0.25W PC PIN TOP; Device Class L1: Passive Components; Octopart: https://octopart.com/3266w-1-103lf-bourns-81445; Height: 9.02mm; Temperature Range High: +125°C; Series: 3266; Temperature Range Low: -55°C; Composition: Cermet; Resistance: 10kΩ; Lead Free: Yes; RoHS: TRUE; Automotive: No; Package: 3266W; Temperature: -55°C to +125°C
R44 = CSSH2728FT5L00: No Description Available; Mfr_Name: Stackpole International; Copyright: Copyright (C) 2022 Ultra Librarian. All rights reserved.; Manufacturer_Part_Number: CSSH2728FT5L00; RefDes: RefDes; Type: DEV
R46 = RES semi: Chip Resistor; Manufacturer: Yageo/Phycomp; Manufacturer P/N: RC0603FR-0749R9L; numsch: 021; TypeNum: 212; Parameters: 49.9R, RC, 0.1W, ±1%, TCR ±100ppm; Power: *; TCR: *; Series: *; Tolerance: *

## Nets that join several sheets
+12V: PA-CONTROL (IC6.9 IC12.9), PA-HF_100W (12 pins), PA-VHF_60W (NT5.2 R44.1)
+12V_FAN: PA-CONTROL (5 pins), PA-HF_100W (FB7.2)
GND: PA-HF_100W-VHF_60W (41 pins), PA-CONTROL (70 pins), PA-HF_100W (47 pins), PA-LPF (72 pins), PA-VHF_60W (29 pins)
DRV_CURR_N: PA-CONTROL (R75.1), PA-HF_100W (NT1.1)
DRV_CURR_P: PA-CONTROL (R74.1), PA-HF_100W (NT3.1)
NetK3_2: PA-HF_100W-VHF_60W (K3.2 K3.7), PA-LPF (16 pins)
NetK3_4: PA-HF_100W-VHF_60W (K3.4 K3.5), PA-VHF_60W (L8.2)
NetK4_2: PA-HF_100W-VHF_60W (K4.2 K4.7), PA-HF_100W (R10.1 R16.2)
NetK4_4: PA-HF_100W-VHF_60W (K4.4 K4.5), PA-VHF_60W (R36.1 R37.2)
NetK6_4: PA-HF_100W (R11.2 R12.2 R13.2 TR2.2), PA-LPF (16 pins)
OUT_CURR_N: PA-CONTROL (R83.1), PA-HF_100W (NT2.1)
OUT_CURR_P: PA-CONTROL (R81.1), PA-HF_100W (NT4.1)
TX: PA-HF_100W-VHF_60W (L1.2 L2.2), PA-CONTROL (IC6.17)
VHF_AMP_ON: PA-HF_100W-VHF_60W (L3.2 L4.1), PA-CONTROL (IC6.18)
VHF_BIAS_ON: PA-CONTROL (Q8.3), PA-VHF_60W (Q6.1 R46.2)
VHF_CURR_N: PA-CONTROL (R78.1), PA-VHF_60W (NT6.1)
VHF_CURR_P: PA-CONTROL (R77.1), PA-VHF_60W (NT5.1)